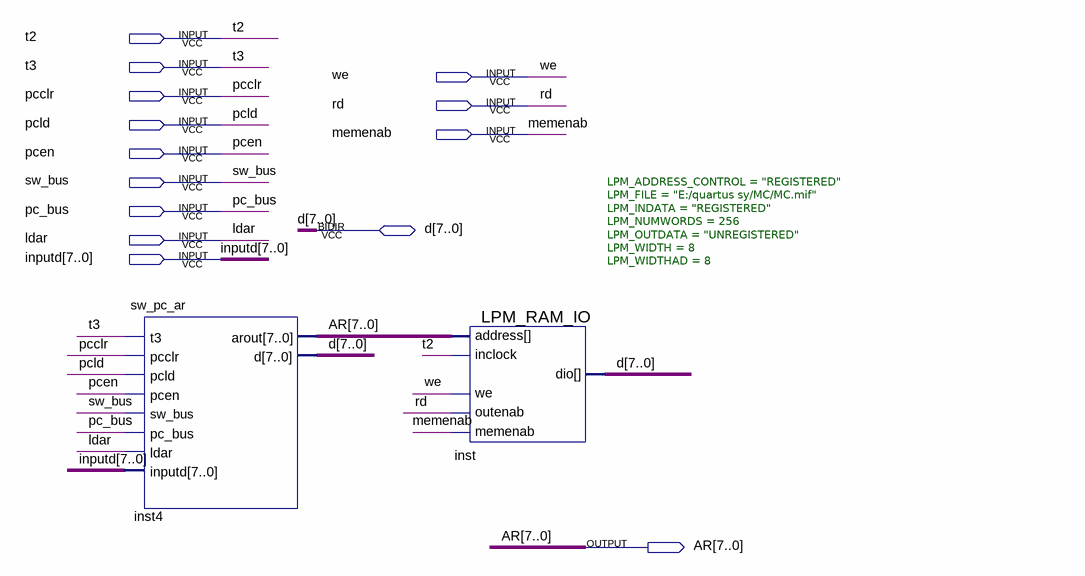
[diagram p0: schematic sheet]
// Quartus schematic ccq.bdf as structural Verilog: 2 symbols, 14 pins
module ccq (
  input  t2,
  input  t3,
  input  we,
  input  pcclr,
  input  rd,
  input  pcld,
  input  memenab,
  input  pcen,
  input  sw_bus,
  input  pc_bus,
  input  ldar,
  input  [7:0] inputd,
  inout  [7:0] d,
  output [7:0] AR
);

  sw_pc_ar inst4 (
    .t3(t3), .pcclr(pcclr), .pcld(pcld), .pcen(pcen), .sw_bus(sw_bus), .pc_bus(pc_bus), .ldar(ldar),
    .inputd(inputd), .arout(AR), .d(d));
  LPM_RAM_IO #(.LPM_ADDRESS_CONTROL("REGISTERED"), .LPM_FILE("E:/quartus sy/MC/MC.mif"), .LPM_INDATA("REGISTERED"), .LPM_NUMWORDS(256), .LPM_OUTDATA("UNREGISTERED"), .LPM_WIDTH(8), .LPM_WIDTHAD(8)) inst (
    .address(AR), .memenab(memenab), .inclock(t2), .we(we), .outenab(rd), .dio(d));
endmodule
